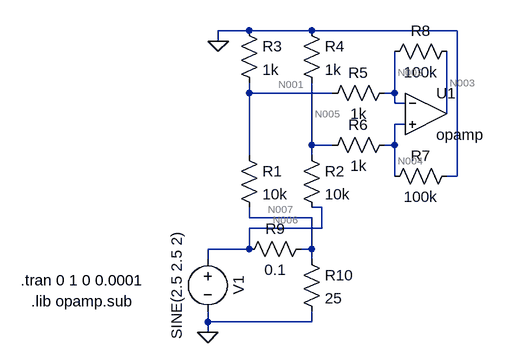
[diagram p0: schematic Draft2.asc]
Draft2.asc, the LTspice schematic file:
Version 4
SHEET 1 880 680
WIRE -80 -32 -128 -32
WIRE 16 -32 -80 -32
WIRE 240 -32 16 -32
WIRE -128 -16 -128 -32
WIRE -80 64 -80 48
WIRE 48 64 -80 64
WIRE 144 64 144 0
WIRE 144 64 128 64
WIRE 144 80 144 64
WIRE 160 80 144 80
WIRE 224 96 224 0
WIRE 160 112 144 112
WIRE 16 144 16 48
WIRE 48 144 16 144
WIRE 144 144 144 112
WIRE 144 144 128 144
WIRE -80 160 -80 64
WIRE 16 160 16 144
WIRE 144 192 144 144
WIRE 240 192 240 -32
WIRE 240 192 224 192
WIRE 32 240 16 240
WIRE -80 256 -80 240
WIRE 16 256 -80 256
WIRE 32 272 32 240
WIRE 32 272 -80 272
WIRE -80 304 -80 272
WIRE -80 304 -144 304
WIRE 16 304 16 256
WIRE 16 304 0 304
WIRE -144 320 -144 304
WIRE 16 320 16 304
WIRE -144 416 -144 400
WIRE 16 416 16 400
WIRE 16 416 -144 416
WIRE -144 432 -144 416
FLAG -128 -16 0
FLAG -144 432 0
SYMBOL OpAmps\\opamp 192 32 R0
SYMATTR InstName U1
SYMBOL res -96 144 R0
SYMATTR InstName R1
SYMATTR Value 10k
SYMBOL res 0 144 R0
SYMATTR InstName R2
SYMATTR Value 10k
SYMBOL res -96 -48 R0
SYMATTR InstName R3
SYMATTR Value 1k
SYMBOL res 0 -48 R0
SYMATTR InstName R4
SYMATTR Value 1k
SYMBOL res 144 48 R90
WINDOW 0 0 56 VBottom 2
WINDOW 3 32 56 VTop 2
SYMATTR InstName R5
SYMATTR Value 1k
SYMBOL res 144 128 R90
WINDOW 0 0 56 VBottom 2
WINDOW 3 32 56 VTop 2
SYMATTR InstName R6
SYMATTR Value 1k
SYMBOL res 240 176 R90
WINDOW 0 0 56 VBottom 2
WINDOW 3 32 56 VTop 2
SYMATTR InstName R7
SYMATTR Value 100k
SYMBOL res 240 -16 R90
WINDOW 0 0 56 VBottom 2
WINDOW 3 32 56 VTop 2
SYMATTR InstName R8
SYMATTR Value 100k
SYMBOL voltage -144 304 R0
WINDOW 0 32 56 VTop 2
WINDOW 3 -32 56 VBottom 2
WINDOW 123 0 0 Left 0
WINDOW 39 0 0 Left 0
SYMATTR InstName V1
SYMATTR Value SINE(2.5 2.5 2)
SYMBOL res 16 288 R90
WINDOW 0 0 56 VBottom 2
WINDOW 3 32 56 VTop 2
SYMATTR InstName R9
SYMATTR Value 0.1
SYMBOL res 0 304 R0
SYMATTR InstName R10
SYMATTR Value 25
TEXT -432 352 Left 2 !.tran 0 1 0 0.0001
TEXT -416 384 Left 2 !.lib opamp.sub

The netlist it stands for:
* Draft2.asc
XU1 N002 N004 N003 opamp Aol=100K GBW=10Meg  ; pins invin noninvin out
R1 N001 N007 10k
R2 N005 N006 10k
R3 0 N001 1k
R4 0 N005 1k
R5 N002 N001 1k
R6 N004 N005 1k
R7 0 N004 100k
R8 N003 N002 100k
V1 N006 0 SINE(2.5 2.5 2)
R9 N007 N006 0.1
R10 N007 0 25
.tran 0 1 0 0.0001
.lib opamp.sub
.backanno
.end

* Results of the author's LTspice run, read from the files saved beside the schematic
* Operating Point, zero values left out:
*   V(n003) = 47.51 mV
*   V(n004) = 223 mV
*   V(n002) = 223 mV
*   V(n001) = 224.8 mV
*   V(n007) = 2.49 V
*   V(n005) = 225.2 mV
*   V(n006) = 2.5 V
*   I(R1) = -226.5 µA
*   I(R2) = -227.5 µA
*   I(R3) = -224.8 µA
*   I(R4) = -225.2 µA
*   I(R5) = -1.755 µA
*   I(R6) = -2.23 µA
*   I(R7) = -2.23 µA
*   I(R8) = -1.755 µA
*   I(R9) = -99.83 mA
*   I(R10) = 99.6 mA
*   I(V1) = -100.1 mA
*   Ix(u1:3) = 1.755 µA
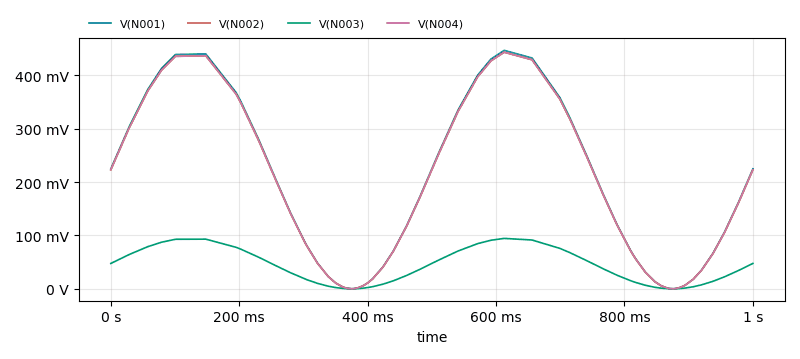
[diagram p1: Transient Analysis of Draft2.asc, plotted from the saved traces]
* Transient Analysis, 1 run:
*   V(N001): min 105.9 nV, max 446.8 mV, average 223.7 mV, rms 274.2 mV, last 224.8 mV
*   V(N002): min 105 nV, max 443.3 mV, average 222 mV, rms 272.1 mV, last 223 mV
*   V(N003): min 22.19 nV, max 94.45 mV, average 47.28 mV, rms 57.97 mV, last 47.51 mV
*   V(N004): min 105 nV, max 443.3 mV, average 222 mV, rms 272.1 mV, last 223 mV